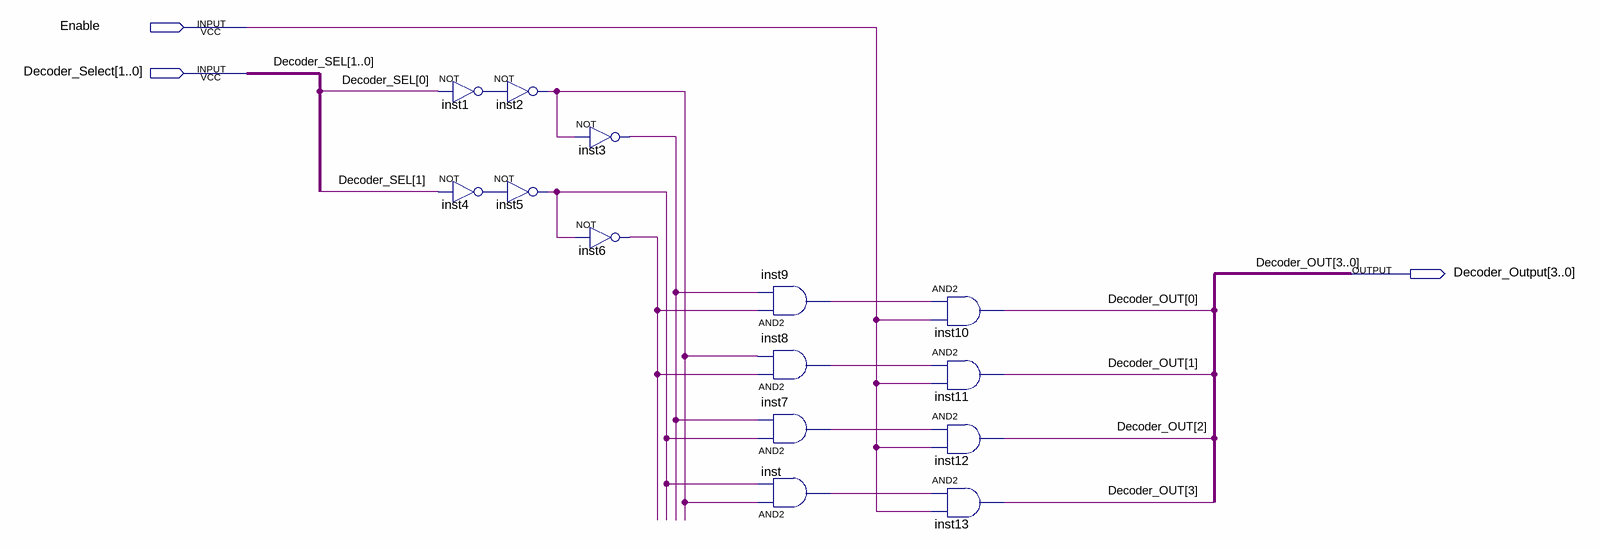
[diagram p0: schematic sheet]
// Quartus schematic 2BitDecoderWithEnable.bdf as structural Verilog: 14 symbols, 3 pins
module \2BitDecoderWithEnable  (
  input  Enable,
  input  [1:0] Decoder_Select,
  output [3:0] Decoder_Output
);

  wire inst1_out, inst2_out, inst3_out, inst4_out, inst5_out, inst6_out, inst7_out, inst8_out, inst9_out,
       inst_out;

  not inst1 (inst1_out, Decoder_Select[0]);
  not inst4 (inst4_out, Decoder_Select[1]);
  not inst2 (inst2_out, inst1_out);
  not inst5 (inst5_out, inst4_out);
  not inst3 (inst3_out, inst2_out);
  not inst6 (inst6_out, inst5_out);
  and inst9 (inst9_out, inst6_out, inst3_out);
  and inst8 (inst8_out, inst6_out, inst2_out);
  and inst7 (inst7_out, inst5_out, inst3_out);
  and inst (inst_out, inst2_out, inst5_out);
  and inst10 (Decoder_Output[0], inst9_out, Enable);
  and inst11 (Decoder_Output[1], inst8_out, Enable);
  and inst12 (Decoder_Output[2], inst7_out, Enable);
  and inst13 (Decoder_Output[3], inst_out, Enable);

  // Other names for the same wires on the sheet: Decoder_OUT[3:0] = Decoder_Output; Decoder_SEL[1:0] = Decoder_Select
endmodule
